# Altium schematic sheet Sheet6.SchDoc
size A3; SheetNumber: 1; SheetTotal: 1
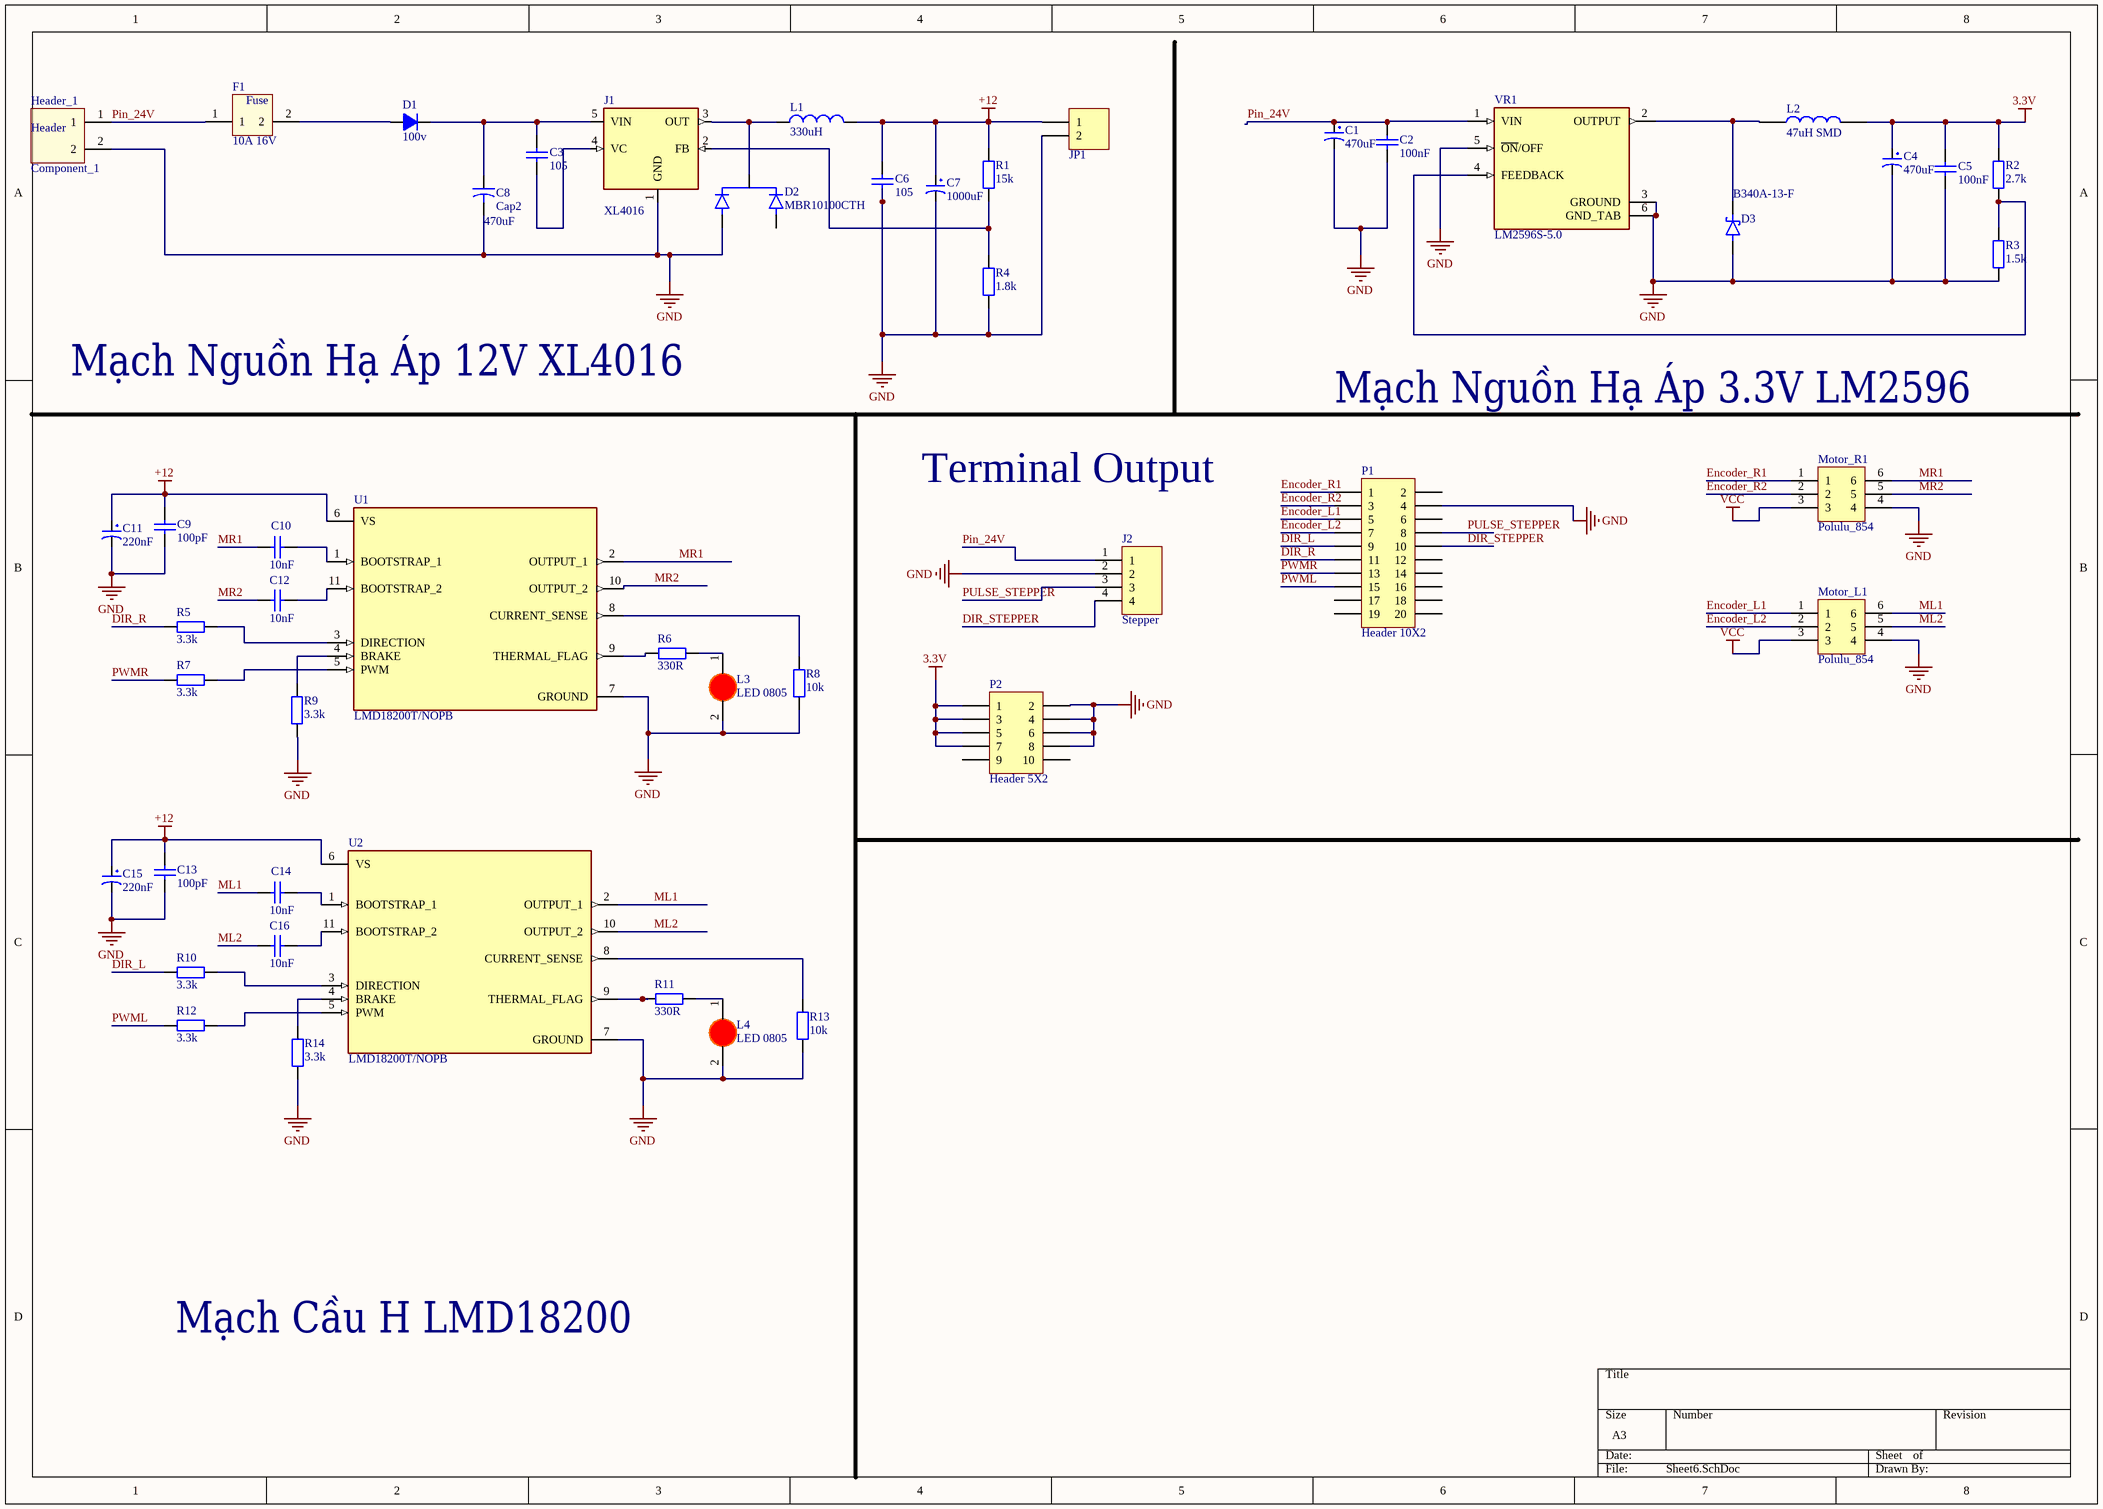
[diagram p0: Sheet6.SchDoc]

## Parts
C1  470uF  [tu hoa 8mm]
C2  100nF  [tu tantalum dip5.08]
C3  105  [tu 0805]
C4  470uF  [tu hoa 8mm]
C5  100nF  [tu tantalum dip5.08]
C6  105  [tu 0805]
C7  1000uF  [tu hoa 13mm]
C8  Cap2  value 470uF  [CAPR5-4X5]
C9  100pF  [tu 1206]
C10  10nF  [tu tantalum dip5.08]
C11  220nF  [tu hoa 8mm]
C12  10nF  [tu tantalum dip5.08]
C13  100pF  [tu 1206]
C14  10nF  [tu tantalum dip5.08]
C15  220nF  [tu hoa 8mm]
C16  10nF  [tu tantalum dip5.08]
D1  100v  [DIODE 1A]
D2  MBR10100CTH  [TO254P1050X476X2020-3]
D3  B340A-13-F  [DIOM5226X240N]
F1  10A 16V  [Auto_Fuse]
Header_1  Component_1  [CONN-TH_2P-P9.50_HB9500-9.5-2P]
J1  XL4016  [LM2576T2]
J2  Stepper  [CON4_78_B4B-PH-K-S(LF)(SN)]
JP1  Header 2_1  [HED2]  (value not drawn)
L1  330uH  [IND_30.1MM_TH]
L2  47uH SMD  [Cuon Cam 7x7x5]
L3  LED 0805  [LED-0805-Red]
L4  LED 0805  [LED-0805-Red]
Motor_L1  Polulu_854  [CON6_100_59D78_TH_ST - duplicate]
Motor_R1  Polulu_854  [CON6_100_59D78_TH_ST - duplicate]
P1  Header 10X2  [HDR2X10]
P2  Header 5X2  [HDR2X5]
R1  15k  [tro vach 1/4w]
R2  2.7k  [tro smd 0805]
R3  1.5k  [tro smd 0805]
R4  1.8k  [tro vach 1/4w]
R5  3.3k  [tro smd 0805]
R6  330R  [Tro SMD 0805]
R7  3.3k  [tro smd 0805]
R8  10k  [tro smd 0805]
R9  3.3k  [tro smd 0805]
R10  3.3k  [tro smd 0805]
R11  330R  [Tro SMD 0805]
R12  3.3k  [tro smd 0805]
R13  10k  [tro smd 0805]
R14  3.3k  [tro smd 0805]
U1  LMD18200T/NOPB  [LMD18200]
U2  LMD18200T/NOPB  [LMD18200]
VR1  LM2596S-5.0  [TO170P1524X483-6N]

## Nets
3.3V: C4.1 C5.1 L2.2 P2.1 P2.3 P2.5 P2.7 R2.2
+12: C6.1 C7.1 C9.1 C11.1 C13.1 C15.1 JP1.1 L1.2 R1.2 U1.6(VS) U2.6(VS)
GND: C1.2 C2.2 C4.2 C5.2 C6.2 C7.2 C8.2 C9.2 C11.2 C13.2 C15.2 D2.1(A1) D3.A Header_1.2 J1.1(GND) J2.2 JP1.2 L3.2(K) L4.2(K) Motor_L1.4 Motor_R1.4 P1.4 P2.2 P2.4 P2.6 P2.8 R3.1 R4.1 R8.1 R9.1 R13.1 R14.1 U1.7(GROUND) U2.7(GROUND) VR1.3(GROUND) VR1.5(~{ON}/OFF) VR1.6(GND_TAB)
VCC: Motor_L1.3 Motor_R1.3
DIR_L: P1.9 R10.1
DIR_R: P1.11 R5.1
DIR_STEPPER: J2.4 P1.10
Encoder_L1: Motor_L1.1 P1.5
Encoder_L2: Motor_L1.2 P1.7
Encoder_R1: Motor_R1.1 P1.1
Encoder_R2: Motor_R1.2 P1.3
ML1: C14.2 Motor_L1.6 U2.2(OUTPUT_1)
ML2: C16.2 Motor_L1.5 U2.10(OUTPUT_2)
MR1: C10.2 Motor_R1.6 U1.2(OUTPUT_1)
MR2: C12.2 Motor_R1.5 U1.10(OUTPUT_2)
Pin_24V: C1.1 C2.1 F1.1 Header_1.1 J2.1 VR1.1(VIN)
PULSE_STEPPER: J2.3 P1.8
PWML: P1.15 R12.1
PWMR: P1.13 R7.1
NetC3_1: C3.1 C8.1 D1.2(K) J1.5(VIN)
NetC3_2: C3.2 J1.4(VC)
NetC10_1: C10.1 U1.1(BOOTSTRAP_1)
NetC12_1: C12.1 U1.11(BOOTSTRAP_2)
NetC14_1: C14.1 U2.1(BOOTSTRAP_1)
NetC16_1: C16.1 U2.11(BOOTSTRAP_2)
NetD1_1: D1.1(A) F1.2
NetD2_2: D2.2(C) J1.3(OUT) L1.1
NetD3_C: D3.C L2.1 VR1.2(OUTPUT)
NetJ1_2: J1.2(FB) R1.1 R4.2
NetL3_1: L3.1(A) R6.2
NetL4_1: L4.1(A) R11.2
NetR2_1: R2.1 R3.2 VR1.4(FEEDBACK)
NetR5_2: R5.2 U1.3(DIRECTION)
NetR6_1: R6.1 U1.9(THERMAL_FLAG)
NetR7_2: R7.2 U1.5(PWM)
NetR8_2: R8.2 U1.8(CURRENT_SENSE)
NetR9_2: R9.2 U1.4(BRAKE)
NetR10_2: R10.2 U2.3(DIRECTION)
NetR11_1: R11.1 U2.9(THERMAL_FLAG)
NetR12_2: R12.2 U2.5(PWM)
NetR13_2: R13.2 U2.8(CURRENT_SENSE)
NetR14_2: R14.2 U2.4(BRAKE)

Not connected (* = marked no-connect by the designer): D2 3(A2); P1 2 6 12 14 16 17 18 19 20; P2 9 10

## Notes on the sheet
- Mạch Nguồn Hạ Áp 12V XL4016
- Mạch Nguồn Hạ Áp 3.3V LM2596
- Terminal Output
- Mạch Cầu H LMD18200
- (in symbol Auto_Fuse_10A) Fuse
- (in symbol Component_1) Header

## Library data of the parts
C1 C4 = Tu Hoa 470uF 16V 8x11: Cắm; Don_Vi: Con; So_Chan: 2; Ten_Linh_Kien: Tụ Hóa 470uF 16V 8x11MM; Ma_Hang: MH006550; Chung_Loai: Cắm; Kieu_Chan: *
C2 C5 = Tu tantalum 100nF 50V 20% DIP5.08: Cắm; Don_Vi: Con; So_Chan: 2; Ten_Linh_Kien: Tụ tantalum 104-100nF 50V 20% DIP5.08 (sứ vàng)(10PCS); Ma_Hang: MH003955; Chung_Loai: Cắm; Kieu_Chan: *
C3 C6 = Tu 0805 105 50V 10%: Dán; Don_Vi: Con; So_Chan: 2; Ten_Linh_Kien: Tụ 0805 105-1uF 10% 50V; Ma_Hang: MH004552; Chung_Loai: Dán; Kieu_Chan: *
C7 = Tu Hoa 1000uF 50V 13x26: Cắm; Don_Vi: Con; So_Chan: 2; Ten_Linh_Kien: Tụ Hóa 1000uF 50V; Ma_Hang: MH006619; Chung_Loai: Cắm; Kieu_Chan: *
C8 = Cap2: Capacitor; Published: 23-Sep-2002; PackageReference: CAPR5-4X5; Publisher: Altium Limited; PackageDescription: Capacitor; 2 Leads
C9 C13 = Tu 1206 100pF 50V 5%: Dán; Don_Vi: Con; So_Chan: 2; Ten_Linh_Kien: Tụ 1206 100P 5% 50V; Ma_Hang: MH008101; Chung_Loai: Dán; Kieu_Chan: *
C10 C12 C14 C16 = Tu tantalum 10nF DIP5.08: Cắm; Don_Vi: Con; So_Chan: 2; Ten_Linh_Kien: Tụ tantalum 103-10nF DIP5.08 (sứ vàng)(10PCS); Ma_Hang: MH002105; Chung_Loai: Cắm; Kieu_Chan: *
C11 C15 = Tu Hoa 220uF 35V 8x12: Cắm; Don_Vi: Con; So_Chan: 2; Ten_Linh_Kien: Tụ Hóa 220uF 35V 8x12MM; Ma_Hang: MH006553; Chung_Loai: Cắm; Kieu_Chan: *
D1 = Diode 1N4007: Cắm; Ten_Linh_Kien: Diode 1N4007 1A (DIP); Don_Vi: Con; Ma_Hang: MH001063; Ghi Chu: *; Kieu_Chan: *; Chung_Loai: Cắm
D2 = MBR10100CTH: 10A, 100V, Schottky Rectifier; MF: Taiwan Semiconductor; MP: MBR10100CTH; Value: *; Check_prices: https://www.snapeda.com/parts/MBR10100CTH/Taiwan+Semiconductor/view-part/?ref=eda; Package: TO-220AB Taiwan Semiconductor; Price: None; Availability: Not in stock; SnapEDA_Link: https://www.snapeda.com/parts/MBR10100CTH/Taiwan+Semiconductor/view-part/?ref=snap
D3 = B340A-13-F: Diode Schottky 40V 3A Surface Mount SMA; MF: Diodes Inc.; Availability: Unavailable; MP: B340A-13-F; Price: None; Value: *; SnapEDA_Link: https://www.snapeda.com/parts/B340A-13-F/Diodes%20Inc./view-part/78704/?ref=snap; Package: DO-214 Diodes Inc.
F1 = Auto_Fuse_10A
J1 = XL4016: The XL4016 is a 180 KHz fixed frequencyPWM buck (step-down) DC/DC converter,capable of driving a 8A load with highefficiency, low ripple and excellent line and load regulation.; MF: XLSEMI; Package: None; Price: None; Value: *; SnapEDA_Link: https://www.snapeda.com/parts/XL4016/XLSEMI/view-part/?ref=snap; MP: XL4016; Availability: Not in stock; Check_prices: https://www.snapeda.com/parts/XL4016/XLSEMI/view-part/?ref=eda
J2 = CON-PLG_4X1-78-ST-TH: Connector Header Through Hole 4 position 0.079" (2.00mm); Manufacturer Part Number: B4B-PH-K-S(LF)(SN); Manufacturer: JST; Mating Part Number: PHR-4; Crimp Part Number: ASPHSPH24K51; Alternate Part Number-1: NA; Case/Package: TH; Supplier-1: SP Road; Supplier Part Number-1: NA
JP1 = Header 2_1: Header, 2-Pin; Manufacturer: Generic Components; Class: Connector; Value: Header 2
L1 = IND_330uH-10A-TH: 330uH-10A-CHINESE INDUCTOR; Manufacturer Part Number: NA; Case/Package: TH; Manufacturer: NA; Supplier-1: SP ROAD; Supplier Part Number-1: NA; Alternate Part Number-1: NA
L2 = CUON CAM 47uH SMD: Dán; Don_Vi: Con; Ma_Hang: MH004211; Ten_Linh_Kien: Cuộn Cảm 47uH 7x7x4MM CD74R; Ghi_Chu: *; Kieu_Chan: *; Chung_Loai: Dán
L3 L4 = LED 0805 Do: Dán; Don_Vi: Con; Ma_Hang: MH000897; Ten_Linh_Kien: LED 0805 Màu Đỏ (Red); Ghi_Chu: *; Kieu_Chan: *; Chung_Loai: Dán
Motor_L1 Motor_R1 = CON-PLG_2X3-100-ST-TH: 6-pin shrouded male headers are great general-purpose connectors and are perfect for AVR ISP programming; Manufacturer: NA; Manufacturer Part Number: NA; Case/Package: TH; Supplier-1: Polulu; Supplier Part Number-1: Polulu_854; Alternate Part Number-1: NA
P1 = Header 10X2: Header, 10-Pin, Dual row; LatestRevisionDate: 17-Jul-2002; LatestRevisionNote: Re-released for DXP Platform.; Publisher: Altium Limited
P2 = Header 5X2: Header, 5-Pin, Dual row; LatestRevisionDate: 17-Jul-2002; LatestRevisionNote: Re-released for DXP Platform.; Publisher: Altium Limited
R1 = Tro Vach 1/4W 5% 15k: Cắm; Don_Vi: Con; So_Chan: 2; Ten_Linh_Kien: Trở Vạch 1/4w 5% 15k; Ma_Hang: MH007288; Chung_Loai: Cắm; Kieu_Chan: *
R2 = Tro 0805 5% 2.7k: Dán; Don_Vi: Con; So_Chan: 2; Ten_Linh_Kien: Trở 0805 5% 2.7k; Ma_Hang: MH005238; Chung_Loai: Dán; Kieu_Chan: *
R3 = Tro 0805 5% 1.5k: Dán; Don_Vi: Con; So_Chan: 2; Ten_Linh_Kien: Trở 0805 5% 1.5k; Ma_Hang: MH005232; Chung_Loai: Dán; Kieu_Chan: *
R4 = Tro Vach 1/4W 5% 1.8k: Cắm; Don_Vi: Con; So_Chan: 2; Ten_Linh_Kien: Trở Vạch 1/4w 5% 1.8k; Ma_Hang: MH007285; Chung_Loai: Cắm; Kieu_Chan: *
R5 R7 R9 R10 R12 R14 = Tro 0805 5% 3.3k: Dán; Don_Vi: Con; So_Chan: 2; Ten_Linh_Kien: Trở 0805 5% 3.3k; Ma_Hang: MH005305; Chung_Loai: Dán; Kieu_Chan: *
R6 R11 = Tro 0805 5% 330R: Dán; Don_Vi: Con; So_Chan: 2; Ten_Linh_Kien: Trở 0805 5% 330R; Ma_Hang: MH005337; Chung_Loai: Dán; Kieu_Chan: *
R8 R13 = Tro 0805 5% 10k: Dán; Don_Vi: Con; So_Chan: 2; Ten_Linh_Kien: Trở 0805 5% 10k; Ma_Hang: MH005239; Chung_Loai: Dán; Kieu_Chan: *
VR1 = LM2596S-5.0: SIMPLE SWITCHER&reg; 4.5V to 40V, 3A Low Component Count Step-Down Regulator; MP: LM2596S-5.0/NOPB; MF: Texas Instruments; Price: None; Availability: In Stock; Package: TO-263-5 Texas Instruments; SnapEDA_Link: https://www.snapeda.com/parts/LM2596S-5.0/NOPB/Texas+Instruments/view-part/?ref=snap; Check_prices: https://www.snapeda.com/parts/LM2596S-5.0/NOPB/Texas+Instruments/view-part/?ref=eda; Value: *; Purchase-URL: https://pricing.snapeda.com/search/part/LM2596S-5.0/NOPB/?ref=eda
U1 U2 = LMD18200T/NOPB: Price: None; Package: None; Availability: Unavailable; MP: LMD18200T/NOPB; Value: *